# EAGLE design atlas_single (EAGLE 9.1.1)
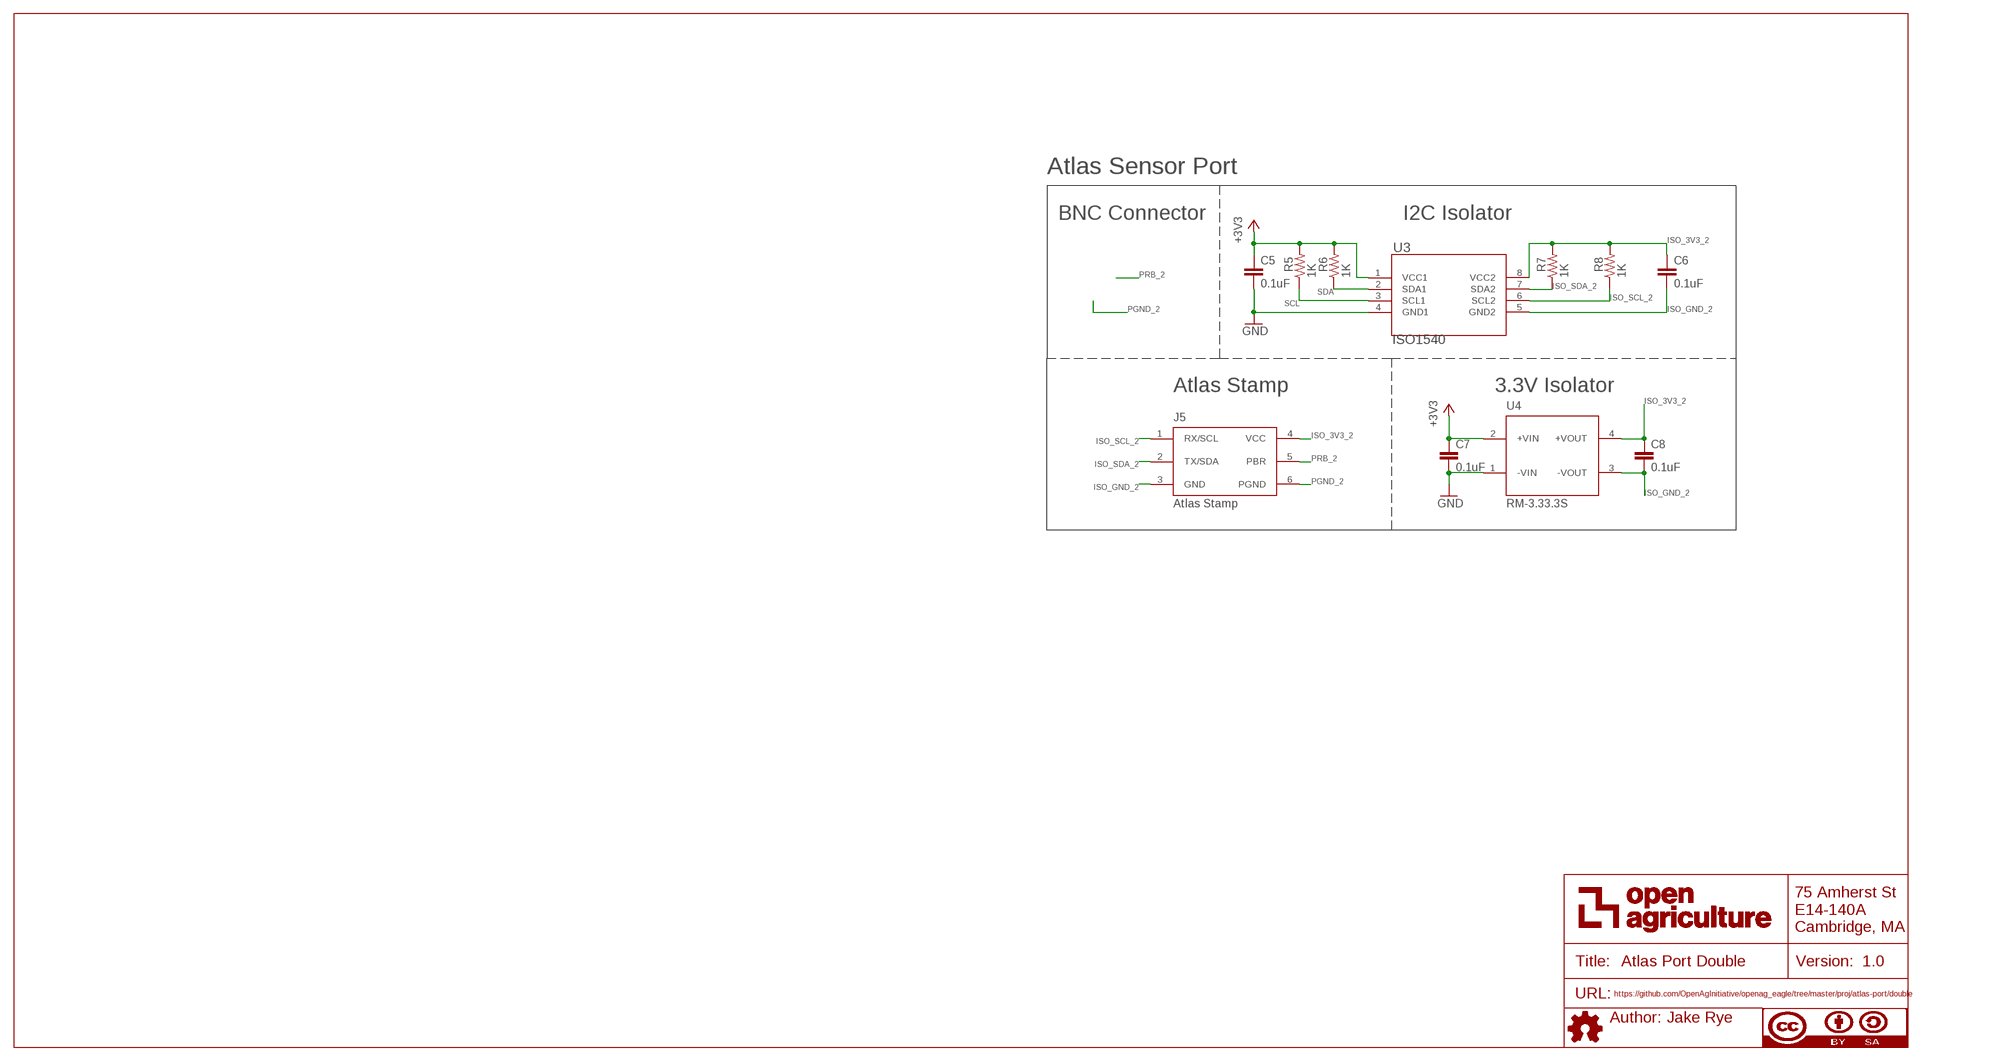
[diagram p0: schematic, sheet 1]
U$4 (DOCFIELD-SCHEMATIC-ONLY): AUTHOR: Jake Rye; MPN: N/A; TITLE: Atlas Port Double; URL: https://github.com/OpenAgInitiative/openag_eagle/tree/master/proj/atlas-port/double; VER: 1.0

## Parts
C5  0.1uF  0.1UF-C0603C104K5RACTU  [C0603]
C6  0.1uF  0.1UF-C0603C104K5RACTU  [C0603]
C7  0.1uF  0.1UF-C0603C104K5RACTU  [C0603]
C8  0.1uF  0.1UF-C0603C104K5RACTU  [C0603]
J5  Atlas Stamp  ATLAS-STAMP  [ATLAS-STAMP]
R5  1K  1K-ERJ-PB3D1001V  [RC0603N]
R6  1K  1K-ERJ-PB3D1001V  [RC0603N]
R7  1K  1K-ERJ-PB3D1001V  [RC0603N]
R8  1K  1K-ERJ-PB3D1001V  [RC0603N]
U3  ISO1540  ISO1540DR  [D8]
U4  RM-3.33.3S  RM3.33.3S  [RM3.33.3S-SIP4]

## Nets
+3V3: C5.1 C7.1 R5.2 R6.2 U3.1(VCC1) U4.2(+VIN)
GND: C5.2 C7.2 U3.4(GND1) U4.1(-VIN)
ISO_3V3_2: C6.1 C8.1 J5.4(VCC) R7.2 R8.2 U3.8(VCC2) U4.4(+VOUT)
ISO_GND_2: C6.2 C8.2 J5.3(GND) U3.5(GND2) U4.3(-VOUT)
ISO_SCL_2: J5.1(RX/SCL) R8.1 U3.6(SCL2)
ISO_SDA_2: J5.2(TX/SDA) R7.1 U3.7(SDA2)
PGND_2: J5.6(PGND)
PRB_2: J5.5(PBR)
SCL: R5.1 U3.3(SCL1)
SDA: R6.1 U3.2(SDA1)

## Notes on the sheet
- Atlas Sensor Port
- BNC Connector | I2C Isolator
- Atlas Stamp | 3.3V Isolator

## Library data of the parts
C5-C8 = openag-capacitors:0.1UF-C0603C104K5RACTU: CAP CER 0.1UF 50V X7R 0603 Description: 0.1µF ±10% 50V Ceramic Capacitor X7R 0603 (1608 Metric) Technical Specifications: Capacitance: 0.1µF Tolerance: ±10% Rated Voltage: 50V Temperature Coefficient: X7R Operating Temperature: -55°C ~ 125°C Package / Case: 0603 (1608 Metric) Datasheet(s): X7R Dielectric, 6.3-250 VDC <https://search.kemet.com/component-edge/download/datasheet/C0603C104K5RACTU.pdf> Vendor(s): Digikey: 399-5089-1-ND <https://www.digikey.com/product-detail/en/kemet/C0603C104K5RACTU/399-5089-1-ND/1465623>; MANUFACTURER: Kemet; MPN: C0603C104K5RACTU; VENDOR: Digikey; VLINK: https://www.digikey.com/product-detail/en/kemet/C0603C104K5RACTU/399-5089-1-ND/1465623; VPN: 399-5089-1-ND
J5 = openag-connectors:ATLAS-STAMP; MPN: N/A
R5-R8 = openag-resistors:1K-ERJ-PB3D1001V: RES SMD 1K OHM 0.5% 1/5W 0603 Description: 1 kOhms ±0.5% 0.2W, 1/5W Chip Resistor 0603 (1608 Metric) Automotive AEC-Q200, Pulse Withstanding Thick Film Technical Specifications: Resistance: 1 kOhms Tolerance: ±0.5% Power: 0.2W, 1/5W Operating Temperature: -55°C ~ 155°C Package / Case: 0603 (1608 Metric) Datasheet(s): ERJ-PB3, PB6 Series, High Precision Datasheet <https://industrial.panasonic.com/cdbs/www-data/pdf/RDM0000/AOA0000C328.pdf> Vendor(s): Digikey: P20283CT-ND <https://www.digikey.com/product-detail/en/panasonic-electronic-components/ERJ-PB3D1001V/P20283CT-ND/6214538>; MANUFACTURER: Panasonic; MPN: P20283CT-ND; VENDOR: Digikey; VLINK: https://www.digikey.com/product-detail/en/panasonic-electronic-components/ERJ-PB3D1001V/P20283CT-ND/6214538; VPN: P20283CT-ND
U3 = openag-isolators:ISO1540DR: DGTL ISO 2.5KV 2CH I2C 8SOIC Description: I²C Digital Isolator 2500Vrms 2 Channel 1Mbps 25kV/µs CMTI 8-SOIC (0.154", 3.90mm Width) Technical Specifications: Technology: Capacitive Coupling Type: I²C Number of Channels: 2 Channel Type: Bidirectional Voltage-Isolation: 2500Vrms Voltage - Supply: 3 V ~ 5.5 V Data Rate: 1Mbps Operating Temperature: -40°C ~ 125°C Package / Case: 8-SOIC (0.154", 3.90mm Width) Max Supply Current (3V ≤ VCC1, VCC2 ≤ 3.6V) Side 1, Side 2: 3.8mA, 3.1mA Datasheet(s): ISO154x <http://www.ti.com/lit/ds/symlink/iso1540.pdf> Vendor(s): Digikey: 296-34871-1-ND <https://www.digikey.com/product-detail/en/texas-instruments/ISO1540DR/296-34871-1-ND/3587214>; MANUFACTURER: Texas Instruments; MPN: ISO1540DR; VENDOR: Digikey; VLINK: https://www.digikey.com/product-detail/en/texas-instruments/ISO1540DR/296-34871-1-ND/3587214; VPN: 296-34871-1-ND
U4 = openag-isolators:RM3.33.3S: CONV DC/DC 0.25W SGL 3.3VOUT SIP Description: Isolated Module DC DC Converter 1 Output 3.3V 76mA 3V - 3.6V Input Technical Specifications: Type: Isolated Module Number of Outputs: 1 Voltage - Input (Min): 3V Voltage - Input (Max): 3.6V Voltage - Output 1: 3.3V Current - Output (Max): 76mA Power (Watts): 250mW Voltage - Isolation: 1kV Applications: ITE (Commercial) Features: SCP Operating Temperature: -40°C ~ 85°C Efficiency: 70% Mounting Type: Through Hole Package / Case: 4-SIP Module Size / Dimension: 0.45" L x 0.24" W x 0.39" H (11.5mm x 6.0mm x 10.0mm) Datasheet(s): RM Series Datasheet <https://www.recom-power.com/pdf/Econoline/RM.pdf> Vendor(s): Digikey: 945-1212-ND <https://www.digikey.com/product-detail/en/recom-power/RM-3.33.3S/945-1212-ND/2256392>; MANUFACTURER: Recom Power; MPN: RM-3.33.3S; VENDOR: Digikey; VLINK: https://www.digikey.com/product-detail/en/recom-power/RM-3.33.3S/945-1212-ND/2256392; VPN: 945-1212-ND

## Board
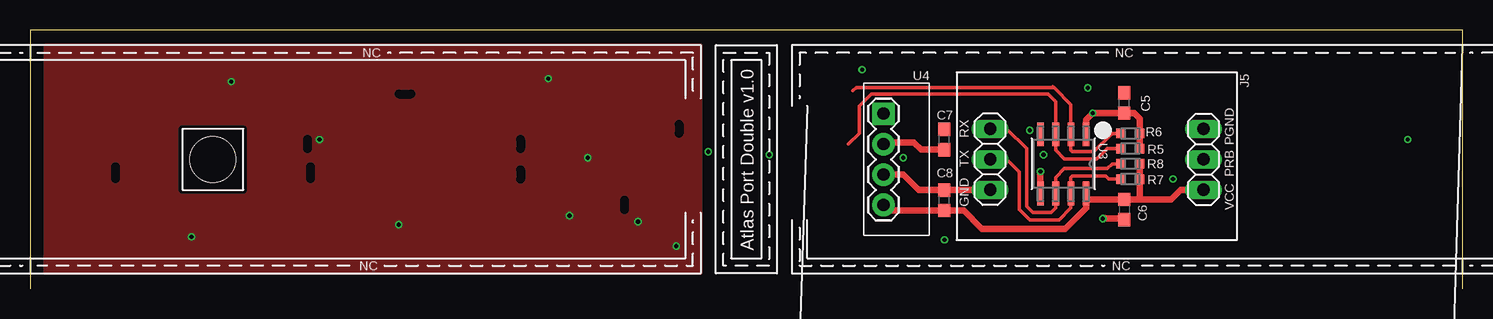
[diagram p1: board, top side]
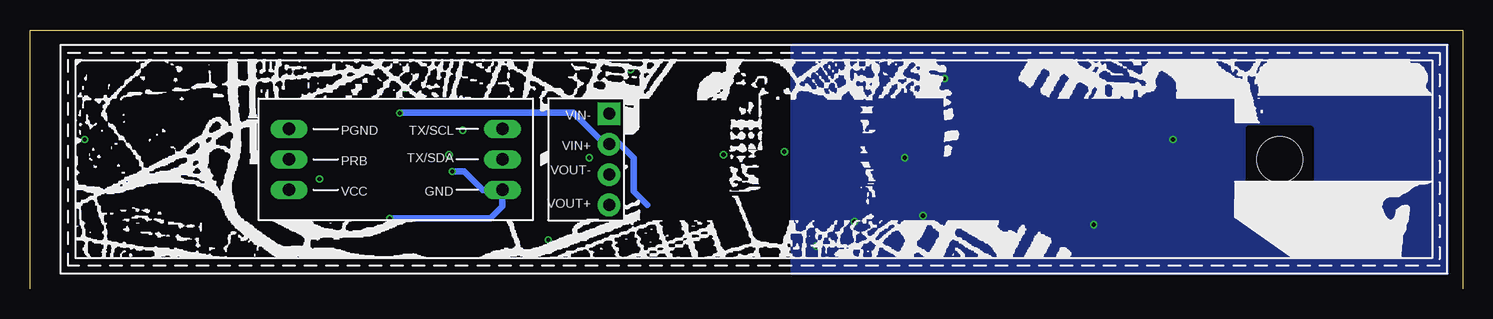
[diagram p2: board, bottom side, seen from below]

Size 119.38 x 21.59 mm. Coordinates in mm from the lower left corner, seen from the top.
Outline: 119.38,0 119.38,21.59 0,21.59 0,0
Copper layers (1*16): Top 0.035559375mm / dielectric 1.6mm / Bottom 0.035559375mm
Design rules "oshpark-2layer-mask": minimum track width 6mil, minimum drill 10mil, track to track 6mil, track to pad 6mil, pad to pad 6mil, via to via 6mil, smd to smd 6mil, copper to edge 15mil, drill to drill 6mil, minimum pad ring 5mil, minimum via ring 5mil, stop-mask expansion 2.5mil, vias tented up to drill 20mil, thermal gap 10mil
tRestrict: 15 lines

### Footprints (pad centres in the part's own frame; a part is rotated, then mirrored left to right if it is on the bottom)
C0603 = smd 1.1 x 1: 1 -0.85,0; 2 0.85,0
ATLAS-STAMP = drill 1.016 long: 1 -8.89,2.54; 2 -8.89,0; 3 -8.89,-2.54; 4 8.89,-2.54; 5 8.89,0; 6 8.89,2.54
RC0603N = smd 0.756 x 0.8: 1 -0.778,0; 2 0.778,0
D8 = smd 1.981 x 0.559: 1 -2.464,1.905; 2 -2.464,0.635; 3 -2.464,-0.635; 4 -2.464,-1.905; 5 2.464,-1.905; 6 2.464,-0.635; 7 2.464,0.635; 8 2.464,1.905
RM3.33.3S-SIP4 = drill 1.016 pad 1.88 square: 1 0,0 | drill 1.016 pad 1.88: 2 2.54,0; 3 5.08,0; 4 7.62,0
HOLE-150 = hole 3.81: 0,0

### Placement (x,y rotation side)
C5  91.19,15.49 90 top
C6  91.19,6.6 270 top
C7  76.2,12.45 90 top
C8  76.2,7.37 90 top
J5  88.9,10.79 0 top
R5  91.69,11.68 0 top
R6  91.69,12.95 0 top
R7  91.69,9.14 0 top
R8  91.69,10.41 0 top
U3  86.11,10.41 270 top
U4  71.12,14.61 270 top
U$1  [HOLE-150]  15.24,10.79 0 top
U$3  [CAMBRIDGE-MAP-X1-ATLAS-DOUBLE-V-1-0]  0,0 0 top

### Tracks (layer width: path | path; a pad name or v marks a point on that pad's centre or on a via)
+3V3  (via drill 0.35)
  Top 0.508: 76.29,11.68 C7.1
  Top 0.559: C7.1 74.26,11.6 73.66,12.19 71.25,12.19 U4.2 | U3.1 88.01,14.1 v88.56,14.64 C5.1 92.04,14.64 92.47,14.21 R6.2 R5.2
  Bottom 0.559: 67.94,6.99 69.09,8.13 69.09,10.92 70.23,12.06 U4.2 71.5,12.06 74.12,14.68 88.52,14.68 v88.56,14.64
GND  (via drill 0.35)
  other vias: 30.73,5.33 24.13,12.45 13.46,4.32 16.76,17.27 43.18,17.53 83.31,13.21 88.14,16.76 95.25,9.14 76.2,4.06 46.48,10.92 44.96,6.1 50.67,5.59 56.52,11.43 61.59,11.18 72.77,10.92 84.45,11.18 114.81,12.45 53.85,3.56 69.34,18.29
  pour Bottom (isolate 0.305, rank 2): 55.88,1.27 1.27,1.27 1.27,20.32 55.88,20.32
  pour Top (isolate 0.305, rank 2): 1.27,1.27 1.27,20.32 55.88,20.32 55.88,1.27
ISO_3V3_2
  Top 0.559: 92.46,7.45 95.08,7.45 95.89,8.26 J5.4 | 92.46,7.45 C6.1 88.01,7.45 U3.8 88.01,6.73 86.28,5 79.32,5 77.81,6.52 C8.1 71.59,6.52 U4.4 | 92.46,7.45 92.47,7.47 R7.2 R8.2
ISO_GND_2  (via drill 0.35)
  Top 0.559: U4.3 72.77,9.53 74.08,8.22 C8.2 79.97,8.22 J5.3 | U3.5 v84.2,9.78 | v89.41,5.84 91.1,5.84 C6.2
  Bottom 0.559: 81.03,8.13 80.9,8.26 J5.3 | v84.2,9.78 83.19,9.78 81.66,8.26 J5.3 | J5.3 80.01,6.86 81.03,5.84 v89.41,5.84
ISO_SCL_2
  Top 0.305: J5.1 81.41,13.34 83.06,11.68 83.06,6.86 83.57,6.35 85.09,6.35 85.47,6.73 U3.6 85.47,9.27 86.21,10.01 89.76,10.01 90.17,10.41 R8.1
ISO_SDA_2
  Top 0.305: R7.1 89.92,9.14 89.66,9.4 86.87,9.4 86.74,9.27 U3.7 86.74,6.73 85.75,5.74 83.31,5.74 82.45,6.61 82.45,9.75 81.41,10.79 J5.2
PRB_2
  Top 0.559: J5.5 98.17,10.79
SCL
  Top 0.305: R5.1 89.76,11.68 88.9,10.82 86.21,10.82 85.47,11.56 U3.3 85.47,15.62 84.84,16.26 70.1,16.26 69.09,15.24 69.09,12.95 68.2,12.06
SDA
  Top 0.305: 85.34,16.76 86.74,15.37 U3.2 86.74,11.56 86.87,11.43 88.65,11.43 90.17,12.95 R6.1 | 85.34,16.76 85.24,16.87 | 85.34,16.76 68.83,16.76 68.58,16.51

### Text on the board
tPlace: NC | NC | EDGE | EDGE | Atlas Port Double v1.0 | NC | NC